# EAGLE board uDJV_board_2_v1.1 (EAGLE 9.3.1), part 1 of 2
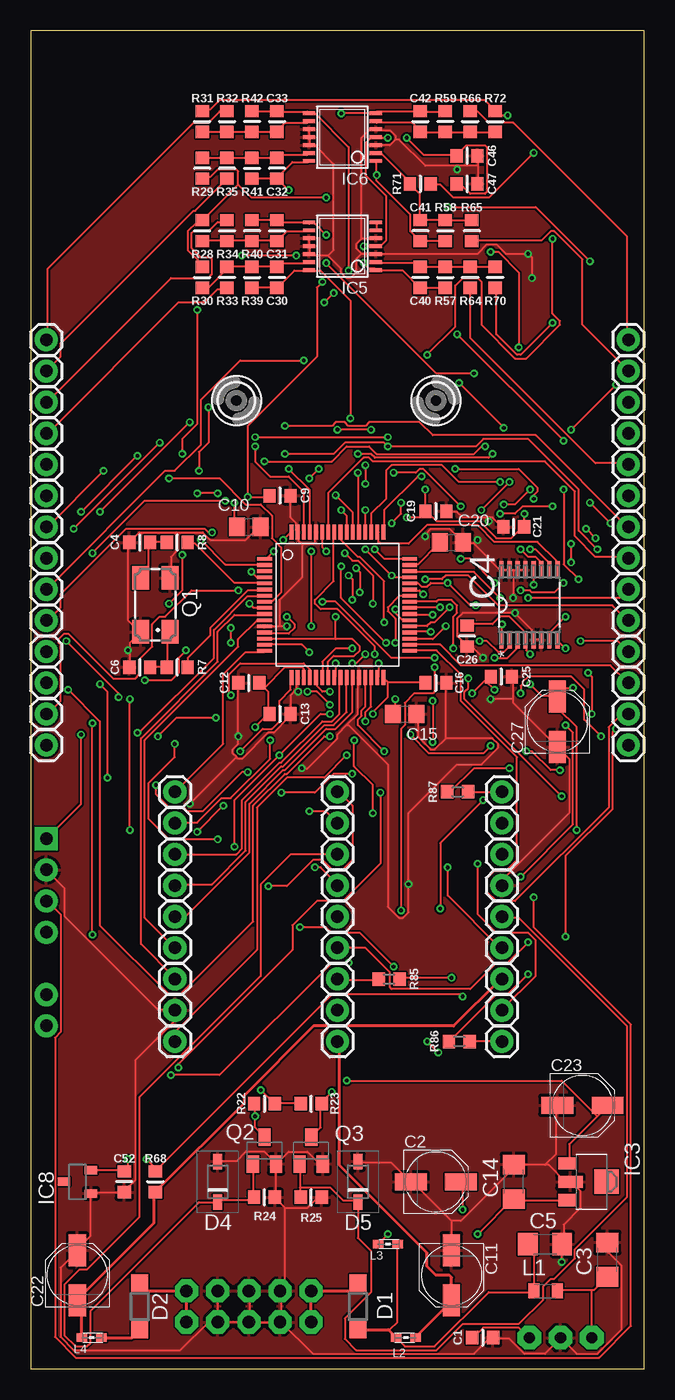
[diagram p5: board, top side]
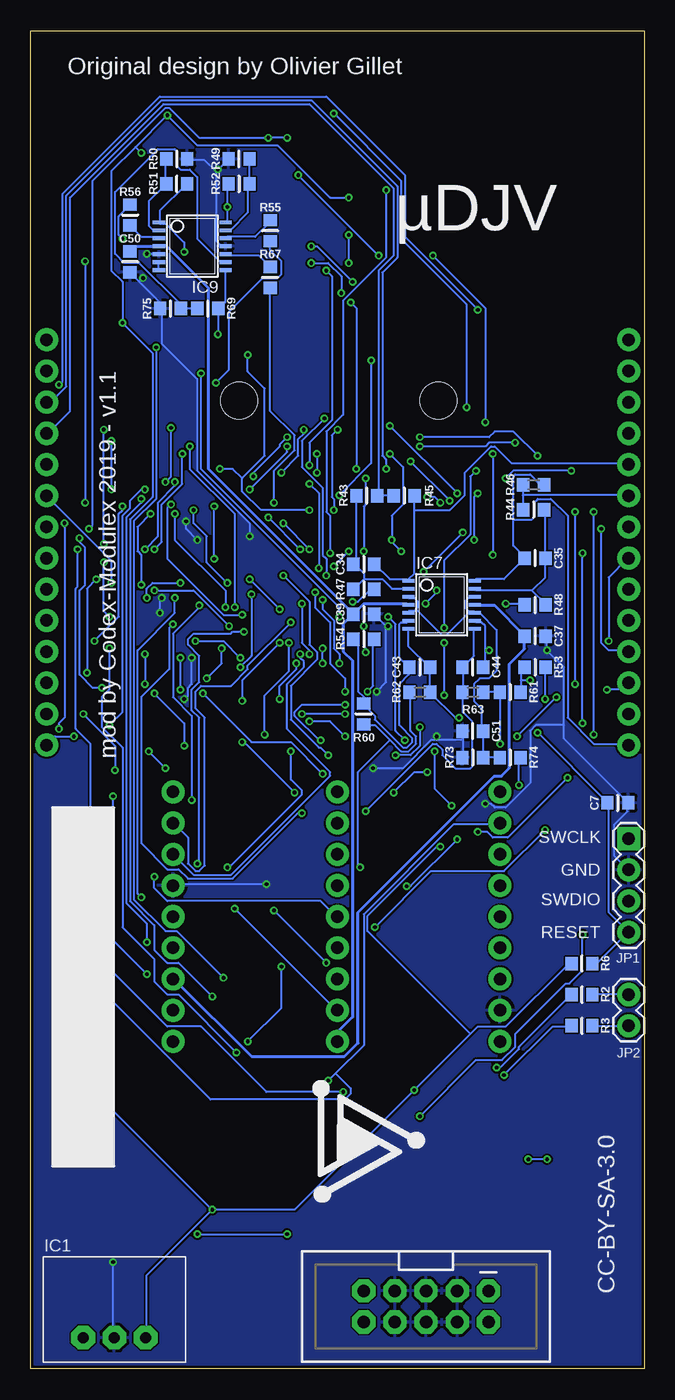
[diagram p6: board, bottom side, seen from below]

Size 50 x 109 mm. Coordinates in mm from the lower left corner, seen from the top.
Outline: 0,0 50,0 50,109 0,109 0,0
Copper layers (1*16): Top 0.035mm / dielectric 1.5mm / Bottom 0.035mm
Design rules "dirt_cheap_dirty_boards.v1.1": minimum track width 6mil, minimum drill 12mil, track to track 6mil, track to pad 6mil, pad to pad 6mil, via to via 6mil, smd to smd 0mil, copper to edge 10mil, drill to drill 10mil, minimum pad ring 10mil, minimum via ring 6mil, stop-mask expansion 2mil, vias tented up to drill 25mil, thermal gap 10mil

## Footprints (pad centres in the part's own frame; a part is rotated, then mirrored left to right if it is on the bottom)
PARTS_AMAN_RESISTOR_0603 = smd 1 x 1.1: 1 -0.85,0; 2 0.85,0
PANASONIC_C = smd 2.6 x 1.4: + 2.05,0; - -2.05,0
C1206 = smd 1.6 x 1.8: 1 -1.4,0; 2 1.4,0
C0805 = smd 1.3 x 1.5: 1 -0.95,0; 2 0.95,0
SOD123 = smd 1.4 x 1.4: A 1.9,0; C -1.9,0
SOD3716X115N = smd 1.25 x 0.75: 1 -1.65,0; 2 1.65,0
3,0TINY = hole 3: 0,0
WE78 = drill 0.9 pad 1.93 octagon: 1 -2.54,0; 2 0,0; 3 2.54,0
TQFP-10X10-64 = smd 1.2 x 0.3: 1 -5.936,3.75; 2 -5.936,3.25; 3 -5.936,2.75; 4 -5.936,2.25; 5 -5.936,1.75; 6 -5.936,1.25; 7 -5.936,0.75; 8 -5.936,0.25; 9 -5.936,-0.25; 10 -5.936,-0.75; 11 -5.936,-1.25; 12 -5.936,-1.75; 13 -5.936,-2.25; 14 -5.936,-2.75; 15 -5.936,-3.25; 16 -5.936,-3.75; 33 5.886,-3.75; 34 5.886,-3.25; 35 5.886,-2.75; 36 5.886,-2.25; 37 5.886,-1.75; 38 5.886,-1.25; 39 5.886,-0.75; 40 5.886,-0.25; 41 5.886,0.25; 42 5.886,0.75; 43 5.886,1.25; 44 5.886,1.75; 45 5.886,2.25; 46 5.886,2.75; 47 5.886,3.25; 48 5.886,3.75 | smd 0.3 x 1.2: 17 -3.75,-5.911; 18 -3.25,-5.911; 19 -2.75,-5.911; 20 -2.25,-5.911; 21 -1.75,-5.911; 22 -1.25,-5.911; 23 -0.75,-5.911; 24 -0.25,-5.911; 25 0.25,-5.911; 26 0.75,-5.911; 27 1.25,-5.911; 28 1.75,-5.911; 29 2.25,-5.911; 30 2.75,-5.911; 31 3.25,-5.911; 32 3.75,-5.911; 49 3.75,5.936; 50 3.25,5.936; 51 2.75,5.936; 52 2.25,5.936; 53 1.75,5.936; 54 1.25,5.936; 55 0.75,5.936; 56 0.25,5.936; 57 -0.25,5.936; 58 -0.75,5.936; 59 -1.25,5.936; 60 -1.75,5.936; 61 -2.25,5.936; 62 -2.75,5.936; 63 -3.25,5.936; 64 -3.75,5.936
SOT89 = smd 1 x 1.5: 1 -1.499,-1.981; 3 1.499,-1.981 | smd 1 x 2: 2 0,-1.727 | smd 2 x 2: 2@1 0,1.194
SOP65P640X110-16N = smd 1.422 x 0.356: 1 -2.845,2.286; 2 -2.845,1.626; 3 -2.845,0.965; 4 -2.845,0.33; 5 -2.845,-0.33; 6 -2.845,-0.965; 7 -2.845,-1.626; 8 -2.845,-2.286; 9 2.845,-2.286; 10 2.845,-1.626; 11 2.845,-0.965; 12 2.845,-0.33; 13 2.845,0.33; 14 2.845,0.965; 15 2.845,1.626; 16 2.845,2.286
TSSOP14_065 = smd 0.305 x 0.991: 1 -1.95,-2.718; 2 -1.3,-2.718; 3 -0.65,-2.718; 4 0,-2.718; 5 0.65,-2.718; 6 1.3,-2.718; 7 1.95,-2.718; 8 1.95,2.718; 9 1.3,2.718; 10 0.65,2.718; 11 0,2.718; 12 -0.65,2.718; 13 -1.3,2.718; 14 -1.95,2.718
DBZ_R-PDSO-G3 = smd 0.7 x 1: 1 -0.95,-1.1; 2 0.95,-1.1; 3 0,1.1
1X04 = drill 1.016 pad 1.88 square: 1 0,0 | drill 1.016 pad 1.88: 2 2.54,0; 3 5.08,0; 4 7.62,0
1X02 = drill 1.016 pad 1.88: 1 0,0; 2 2.54,0
PARTS_AMAN_1X01 = drill 1.016 pad 1.88: 1 0,0
2X5-SHROUDED = drill 1.016 pad 1.88 octagon: 1 -1.27,5.08; 2 1.27,5.08; 3 -1.27,2.54; 4 1.27,2.54; 5 -1.27,0; 6 1.27,0; 7 -1.27,-2.54; 8 1.27,-2.54; 9 -1.27,-5.08; 10 1.27,-5.08
L2012C = smd 0.9 x 1.25: 1 -0.9,0; 2 1,0
0603 = smd 0.85 x 0.7: 1 -0.9,0; 2 0.7,0
CTS406 = smd 1.9 x 1.4: 1 -2.2,-1.2; 2 2.2,-1.2; 3 2.2,1.2; 4 -2.2,1.2
SOT23-BEC = smd 1 x 1.4: B -0.95,-1.1; C 0,1.1; E 0.95,-1.1
R0603 = smd 1 x 1.1: 1 -0.85,0; 2 0.85,0

## Placement (x,y rotation side)
C1  100n  [PARTS_AMAN_RESISTOR_0603]  36.83,2.54 0 top
C2  22u  [PANASONIC_C]  33.02,15.24 0 top
C3  22u  [C1206]  46.99,8.89 90 top
C4  20p  [PARTS_AMAN_RESISTOR_0603]  8.89,67.31 0 top
C5  22u  [C1206]  41.91,10.16 0 top
C6  20p  [PARTS_AMAN_RESISTOR_0603]  8.89,57.15 0 top
C7  100n  [PARTS_AMAN_RESISTOR_0603]  2.16,46.1 0 bottom
C9  100n  [PARTS_AMAN_RESISTOR_0603]  20.32,71.12 0 top
C10  2.2u  [C0805]  17.78,68.58 0 top
C11  22u  [PANASONIC_C]  34.29,7.62 270 top
C12  100n  [PARTS_AMAN_RESISTOR_0603]  17.78,55.88 180 top
C13  100n  [PARTS_AMAN_RESISTOR_0603]  20.32,53.34 0 top
C14  22u  [C1206]  39.37,15.24 90 top
C15  2.2u  [C0805]  30.48,53.34 0 top
C16  100n  [PARTS_AMAN_RESISTOR_0603]  33.02,55.88 0 top
C19  100n  [PARTS_AMAN_RESISTOR_0603]  33.02,69.85 0 top
C20  2.2u  [C0805]  34.29,67.31 0 top
C21  100n  [PARTS_AMAN_RESISTOR_0603]  39.37,68.58 180 top
C22  22u  [PANASONIC_C]  3.81,7.62 90 top
C23  22u  [PANASONIC_C]  44.96,21.46 0 top
C25  470n  [PARTS_AMAN_RESISTOR_0603]  38.35,56.39 0 top
C26  100n  [PARTS_AMAN_RESISTOR_0603]  35.56,59.69 270 top
C27  22u  [PANASONIC_C]  42.93,52.7 90 top
C30  4.7n  [PARTS_AMAN_RESISTOR_0603]  20.07,88.9 270 top
C31  470p  [PARTS_AMAN_RESISTOR_0603]  20.07,92.71 90 top
C32  4.7n  [PARTS_AMAN_RESISTOR_0603]  20.07,97.79 270 top
C33  4.7n  [PARTS_AMAN_RESISTOR_0603]  20.07,101.6 90 top
C34  47p  [PARTS_AMAN_RESISTOR_0603]  22.86,65.53 0 bottom
C35  47p  [PARTS_AMAN_RESISTOR_0603]  8.89,66.04 180 bottom
C37  100n  [PARTS_AMAN_RESISTOR_0603]  8.89,59.69 180 bottom
C39  100n  [PARTS_AMAN_RESISTOR_0603]  22.86,61.47 0 bottom
C40  4.7n  [PARTS_AMAN_RESISTOR_0603]  31.75,88.9 270 top
C41  470p  [PARTS_AMAN_RESISTOR_0603]  31.75,92.71 270 top
C42  4.7n  [PARTS_AMAN_RESISTOR_0603]  31.75,101.6 90 top
C43  47p  [PARTS_AMAN_RESISTOR_0603]  18.29,57.15 0 bottom
C44  47p  [PARTS_AMAN_RESISTOR_0603]  13.97,57.15 180 bottom
C46  100n  [PARTS_AMAN_RESISTOR_0603]  35.56,98.81 0 top
C47  100n  [PARTS_AMAN_RESISTOR_0603]  35.56,96.52 0 top
C50  100n  [PARTS_AMAN_RESISTOR_0603]  41.91,90.17 270 bottom
C51  470n  [PARTS_AMAN_RESISTOR_0603]  13.97,51.94 180 bottom
C52  470n  [PARTS_AMAN_RESISTOR_0603]  7.62,15.24 270 top
D1  1N5819HW  [SOD123]  26.67,5.08 90 top
D2  1N5819HW  [SOD123]  8.89,5.08 270 top
D4  1N4148W-7-F  [SOD3716X115N]  15.24,15.24 90 top
D5  1N4148W-7-F  [SOD3716X115N]  26.67,15.24 90 top
H3  MOUNT-HOLE3.0TINY  [3,0TINY]  33.02,78.87 0 top
H5  MOUNT-HOLE3.0TINY  [3,0TINY]  16.76,78.87 90 top
IC1  R-78E3.3-0.5  [WE78]  43.18,2.54 0 bottom
IC2  STM32F405RGT6  [TQFP-10X10-64]  25,62.23 0 top
IC3  LD2981ABU33  [SOT89]  45.72,15.24 270 top
IC4  DAC8164ICPW  [SOP65P640X110-16N]  40.64,62.23 90 top
IC5  MCP6004  [TSSOP14_065]  25.4,91.44 90 top
IC6  MCP6004  [TSSOP14_065]  25.4,100.33 90 top
IC7  OPA4171  [TSSOP14_065]  16.51,62.23 270 bottom
IC8  LM4040B10  [DBZ_R-PDSO-G3]  3.81,15.24 90 top
IC9  LM324PW  [TSSOP14_065]  36.83,91.44 270 bottom
JP1  [1X04]  1.27,43.18 270 bottom
JP2  [1X02]  1.27,27.94 90 bottom
JP3  GND  [PARTS_AMAN_1X01]  11.75,29.21 0 top
JP4  M05X2SHD  [2X5-SHROUDED]  17.78,5.08 270 bottom
JP5  ADC_T_BIAS_POT  [PARTS_AMAN_1X01]  11.75,46.99 0 top
JP6  ADC_T_RATE_POT  [PARTS_AMAN_1X01]  11.75,31.75 0 top
JP7  ADC_T_JITTER_POT  [PARTS_AMAN_1X01]  11.75,41.91 0 top
JP8  ADC_X_STEPS_POT  [PARTS_AMAN_1X01]  11.75,39.37 0 top
JP9  ADC_X_SPREAD_POT  [PARTS_AMAN_1X01]  1.27,68.58 0 top
JP10  ADC_X_BIAS_POT  [PARTS_AMAN_1X01]  1.27,53.34 0 top
JP11  ADC_DV_POT  [PARTS_AMAN_1X01]  11.75,34.29 0 top
JP12  ADC_LENGTH_POT  [PARTS_AMAN_1X01]  11.75,36.83 0 top
JP13  +3V3_A  [PARTS_AMAN_1X01]  11.75,44.45 0 top
JP14  GND  [PARTS_AMAN_1X01]  38.4,39.37 0 top
JP15  LED_T_DV  [PARTS_AMAN_1X01]  38.4,34.29 0 top
JP16  SW_T_DV  [PARTS_AMAN_1X01]  1.27,55.88 0 top
JP17  LED_X_DV  [PARTS_AMAN_1X01]  1.27,58.42 0 top
JP18  SW_X_DV  [PARTS_AMAN_1X01]  1.27,60.96 0 top
JP19  SW_X_EXT  [PARTS_AMAN_1X01]  1.27,63.5 0 top
JP20  LED_X_EXT_G  [PARTS_AMAN_1X01]  48.7,63.5 0 top
JP21  LED_T_RANGE_R  [PARTS_AMAN_1X01]  48.7,60.96 0 top
JP22  LED_T_RANGE_G  [PARTS_AMAN_1X01]  48.7,58.42 0 top
JP23  J3  [PARTS_AMAN_1X01]  25,41.91 0 top
JP24  J9  [PARTS_AMAN_1X01]  38.4,36.83 0 top
JP25  J1  [PARTS_AMAN_1X01]  48.7,73.66 0 top
JP26  J7  [PARTS_AMAN_1X01]  1.27,81.28 0 top
JP27  J4  [PARTS_AMAN_1X01]  48.7,81.28 0 top
JP28  J8  [PARTS_AMAN_1X01]  1.27,78.74 0 top
JP29  J6  [PARTS_AMAN_1X01]  1.27,83.82 0 top
JP30  SW_T_RANGE  [PARTS_AMAN_1X01]  38.4,29.21 0 top
JP31  J5  [PARTS_AMAN_1X01]  48.7,83.82 0 top
JP32  SW_T_MODE  [PARTS_AMAN_1X01]  48.7,71.12 0 top
JP33  SW_X_MODE  [PARTS_AMAN_1X01]  48.7,68.58 0 top
JP34  SW_X_RANGE  [PARTS_AMAN_1X01]  48.7,66.04 0 top
JP35  LED_T_MODE_R  [PARTS_AMAN_1X01]  48.7,55.88 0 top
JP36  J2  [PARTS_AMAN_1X01]  1.27,76.2 0 top
JP37  NORM_PROBE  [PARTS_AMAN_1X01]  25,36.83 0 top
JP38  J13  [PARTS_AMAN_1X01]  25,39.37 0 top
JP39  LED_T_MODE_G  [PARTS_AMAN_1X01]  48.7,53.34 0 top
JP40  LED_X_MODE_R  [PARTS_AMAN_1X01]  48.7,78.74 0 top
JP41  FROM_IC7B  [PARTS_AMAN_1X01]  1.27,66.04 0 top
JP42  LED_X_MODE_G  [PARTS_AMAN_1X01]  48.7,50.8 0 top
JP43  LED_X_RANGE_R  [PARTS_AMAN_1X01]  38.4,44.45 0 top
JP44  LED_X_RANGE_G  [PARTS_AMAN_1X01]  38.4,41.91 0 top
JP45  J12  [PARTS_AMAN_1X01]  38.4,46.99 0 top
JP46  J14  [PARTS_AMAN_1X01]  48.7,76.2 0 top
JP47  FROM_IC7A  [PARTS_AMAN_1X01]  1.27,73.66 0 top
JP48  J15  [PARTS_AMAN_1X01]  1.27,71.12 0 top
JP49  FROM_IC7D  [PARTS_AMAN_1X01]  1.27,50.8 0 top
JP51  J16  [PARTS_AMAN_1X01]  25,46.99 0 top
JP52  J10  [PARTS_AMAN_1X01]  25,31.75 0 top
JP53  FROM_IC7C  [PARTS_AMAN_1X01]  25,44.45 0 top
JP54  GATE_T_1  [PARTS_AMAN_1X01]  25,34.29 0 top
JP55  J11  [PARTS_AMAN_1X01]  38.4,26.67 0 top
JP56  GATE_T_2  [PARTS_AMAN_1X01]  25,29.21 0 top
JP57  GATE_T_3  [PARTS_AMAN_1X01]  11.75,26.67 0 top
JP58  VCC  [PARTS_AMAN_1X01]  25,26.67 0 top
JP59  VEE  [PARTS_AMAN_1X01]  38.4,31.75 0 top
L1  33u  [L2012C]  41.91,6.35 0 top
L2  [0603]  30.48,2.54 180 top
L3  [0603]  29.21,10.16 0 top
L4  [0603]  5.08,2.54 0 top
Q1  8MHz  [CTS406]  10.16,62.23 90 top
Q2  MMBT3904  [SOT23-BEC]  19.05,17.78 0 top
Q3  MMBT3904  [SOT23-BEC]  22.86,17.78 0 top
R2  100  [PARTS_AMAN_RESISTOR_0603]  5.08,30.48 180 bottom
R3  100  [PARTS_AMAN_RESISTOR_0603]  5.08,27.94 180 bottom
R6  10k  [PARTS_AMAN_RESISTOR_0603]  5.08,33.02 180 bottom
R7  100  [PARTS_AMAN_RESISTOR_0603]  11.94,57.15 180 top
R8  100  [PARTS_AMAN_RESISTOR_0603]  11.94,67.31 180 top
R22  10k  [PARTS_AMAN_RESISTOR_0603]  19.05,21.59 0 top
R23  10k  [PARTS_AMAN_RESISTOR_0603]  22.86,21.59 180 top
R24  100k  [PARTS_AMAN_RESISTOR_0603]  19.05,13.97 180 top
R25  100k  [PARTS_AMAN_RESISTOR_0603]  22.86,13.97 180 top
R28  200k  [PARTS_AMAN_RESISTOR_0603]  13.97,92.71 90 top
R29  200k  [PARTS_AMAN_RESISTOR_0603]  13.97,97.79 270 top
R30  200k  [PARTS_AMAN_RESISTOR_0603]  13.97,88.9 90 top
R31  200k  [PARTS_AMAN_RESISTOR_0603]  13.97,101.6 90 top
R32  100k  [PARTS_AMAN_RESISTOR_0603]  16,101.6 90 top
R33  100k  [PARTS_AMAN_RESISTOR_0603]  16,88.9 270 top
R34  100k  [PARTS_AMAN_RESISTOR_0603]  16,92.71 90 top
R35  100k  [PARTS_AMAN_RESISTOR_0603]  16,97.79 270 top
R39  33k  [PARTS_AMAN_RESISTOR_0603]  18.03,88.9 90 top
R40  33k  [PARTS_AMAN_RESISTOR_0603]  18.03,92.71 270 top
R41  33k  [PARTS_AMAN_RESISTOR_0603]  18.03,97.79 90 top
R42  33k  [PARTS_AMAN_RESISTOR_0603]  18.03,101.6 270 top
R43  100k  [PARTS_AMAN_RESISTOR_0603]  22.61,71.12 180 bottom
R44  100k  [PARTS_AMAN_RESISTOR_0603]  9.02,69.98 0 bottom
R45  1.0k  [PARTS_AMAN_RESISTOR_0603]  19.56,71.12 0 bottom
R46  1.0k  [R0603]  9.02,72.01 0 bottom
R47  23.7k  [PARTS_AMAN_RESISTOR_0603]  22.86,63.5 0 bottom
R48  23.7k  [PARTS_AMAN_RESISTOR_0603]  8.89,62.23 180 bottom
R49  39k  [PARTS_AMAN_RESISTOR_0603]  33.02,98.55 180 bottom
R50  39k  [PARTS_AMAN_RESISTOR_0603]  38.1,98.55 0 bottom
R51  56k  [PARTS_AMAN_RESISTOR_0603]  38.1,96.52 180 bottom
R52  56k  [PARTS_AMAN_RESISTOR_0603]  33.02,96.52 0 bottom
R53  23.7k  [PARTS_AMAN_RESISTOR_0603]  8.89,57.15 0 bottom
R54  23.7k  [PARTS_AMAN_RESISTOR_0603]  22.86,59.44 0 bottom
R55  10k  [PARTS_AMAN_RESISTOR_0603]  30.48,92.71 270 bottom
R56  10k  [PARTS_AMAN_RESISTOR_0603]  41.91,93.98 90 bottom
R57  33k  [PARTS_AMAN_RESISTOR_0603]  33.78,88.9 90 top
R58  33k  [PARTS_AMAN_RESISTOR_0603]  33.78,92.71 90 top
R59  33k  [PARTS_AMAN_RESISTOR_0603]  33.78,101.6 270 top
R60  100k  [PARTS_AMAN_RESISTOR_0603]  22.86,53.34 90 bottom
R61  100k  [PARTS_AMAN_RESISTOR_0603]  10.92,55.12 0 bottom
R62  1.0k  [R0603]  18.29,55.12 0 bottom
R63  1.0k  [R0603]  13.97,55.12 180 bottom
R64  100k  [PARTS_AMAN_RESISTOR_0603]  35.81,88.9 270 top
R65  100k  [PARTS_AMAN_RESISTOR_0603]  35.94,92.71 270 top
R66  100k  [PARTS_AMAN_RESISTOR_0603]  35.81,101.6 90 top
R67  10k  [PARTS_AMAN_RESISTOR_0603]  30.48,88.9 270 bottom
R68  1.0k  [PARTS_AMAN_RESISTOR_0603]  10.16,15.24 90 top
R69  56k  [PARTS_AMAN_RESISTOR_0603]  35.56,86.36 180 bottom
R70  200k  [PARTS_AMAN_RESISTOR_0603]  37.85,88.9 270 top
R71  200k  [PARTS_AMAN_RESISTOR_0603]  31.75,96.52 0 top
R72  200k  [PARTS_AMAN_RESISTOR_0603]  37.85,101.6 90 top
R73  100k  [PARTS_AMAN_RESISTOR_0603]  13.97,49.78 0 bottom
R74  150k  [PARTS_AMAN_RESISTOR_0603]  10.92,49.78 0 bottom
R75  39k  [PARTS_AMAN_RESISTOR_0603]  38.61,86.36 180 bottom
R85  1.0k  [R0603]  29.21,31.75 0 top
R86  1.0k  [R0603]  34.92,26.67 180 top
R87  1.0k  [R0603]  34.8,46.99 180 top